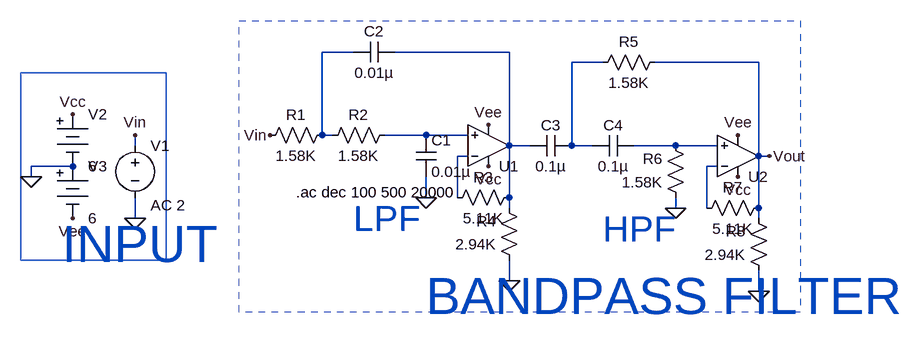
[diagram p0: schematic sallen-key-active-bandpass.asc]
sallen-key-active-bandpass.asc, the LTspice schematic file:
Version 4.1
SHEET 1 880 680
WIRE -112 64 -160 64
WIRE 128 64 -48 64
WIRE 272 80 224 80
WIRE 512 80 352 80
WIRE -160 192 -160 64
WIRE -144 192 -160 192
WIRE 0 192 -64 192
WIRE 64 192 0 192
WIRE -448 208 -448 192
WIRE 128 208 128 64
WIRE 160 208 128 208
WIRE 224 208 224 80
WIRE 256 208 224 208
WIRE 384 208 320 208
WIRE 448 208 384 208
WIRE 64 224 48 224
WIRE 512 224 512 80
WIRE 528 224 512 224
WIRE -544 240 -608 240
WIRE 448 240 432 240
WIRE -608 256 -608 240
WIRE 0 288 0 256
WIRE 48 288 48 224
WIRE 128 288 128 208
WIRE 128 304 128 288
WIRE 384 304 384 288
WIRE 432 304 432 240
WIRE 512 304 512 224
WIRE -448 320 -448 288
WIRE 512 320 512 304
WIRE 128 416 128 384
WIRE 512 432 512 400
FLAG -448 320 0
FLAG -240 192 Vin
FLAG 528 224 Vout
FLAG 0 288 0
FLAG 128 416 0
FLAG -608 256 0
FLAG -544 160 Vcc
FLAG 96 240 Vcc
FLAG -544 320 Vee
FLAG 96 176 Vee
FLAG 384 304 0
FLAG 512 432 0
FLAG 480 256 Vcc
FLAG 480 192 Vee
FLAG -448 192 Vin
SYMBOL OpAmps\\UniversalOpAmp2 96 208 M180
SYMATTR InstName U1
SYMBOL res -144 176 R90
WINDOW 0 0 56 VBottom 2
WINDOW 3 32 56 VTop 2
SYMATTR InstName R1
SYMATTR Value 1.58K
SYMATTR SpiceLine tol=1 pwr=0.1
SYMBOL cap -16 192 R0
SYMATTR InstName C1
SYMATTR Value 0.01µ
SYMATTR SpiceLine V=50 Irms=0 Rser=0.0124 Lser=188p mfg="Würth Elektronik" pn="885012009023 WCAP-CSGP 1210" type="NP0"
SYMBOL voltage -448 192 R0
WINDOW 123 24 108 Left 2
WINDOW 39 0 0 Left 0
SYMATTR Value2 AC 2
SYMATTR InstName V1
SYMATTR Value ""
SYMBOL res -48 176 R90
WINDOW 0 0 56 VBottom 2
WINDOW 3 32 56 VTop 2
SYMATTR InstName R2
SYMATTR Value 1.58K
SYMATTR SpiceLine tol=1 pwr=0.1
SYMBOL res 144 272 R90
WINDOW 0 0 56 VBottom 2
WINDOW 3 32 56 VTop 2
SYMATTR InstName R3
SYMATTR Value 5.11K
SYMATTR SpiceLine tol=1 pwr=0.1
SYMBOL res 144 400 R180
WINDOW 0 36 76 Left 2
WINDOW 3 36 40 Left 2
SYMATTR InstName R4
SYMATTR Value 2.94K
SYMATTR SpiceLine tol=1 pwr=0.1
SYMBOL cap -112 80 R270
WINDOW 0 32 32 VTop 2
WINDOW 3 0 32 VBottom 2
SYMATTR InstName C2
SYMATTR Value 0.01µ
SYMATTR SpiceLine V=50 Irms=0 Rser=0.0124 Lser=188p mfg="Würth Elektronik" pn="885012009023 WCAP-CSGP 1210" type="NP0"
SYMBOL Misc\\battery -544 144 R0
WINDOW 123 0 0 Left 0
WINDOW 39 0 0 Left 0
SYMATTR InstName V2
SYMATTR Value 6
SYMBOL Misc\\battery -544 224 R0
WINDOW 123 0 0 Left 0
WINDOW 39 0 0 Left 0
SYMATTR InstName V3
SYMATTR Value 6
SYMBOL OpAmps\\UniversalOpAmp2 480 224 M180
SYMATTR InstName U2
SYMBOL res 368 64 R90
WINDOW 0 0 56 VBottom 2
WINDOW 3 32 56 VTop 2
SYMATTR InstName R5
SYMATTR Value 1.58K
SYMATTR SpiceLine tol=1 pwr=0.1
SYMBOL cap 224 192 R90
WINDOW 0 0 32 VBottom 2
WINDOW 3 32 32 VTop 2
SYMATTR InstName C3
SYMATTR Value 0.1µ
SYMATTR SpiceLine V=50 Irms=1m Rser=1.9 Lser=2.5p mfg="Würth Elektronik" pn="865090668014 WCAP-ASLU 3.5x3.3" type="Al electrolytic"
SYMBOL res 400 304 R180
WINDOW 0 36 76 Left 2
WINDOW 3 36 40 Left 2
SYMATTR InstName R6
SYMATTR Value 1.58K
SYMATTR SpiceLine tol=1 pwr=0.1
SYMBOL res 528 288 R90
WINDOW 0 0 56 VBottom 2
WINDOW 3 32 56 VTop 2
SYMATTR InstName R7
SYMATTR Value 5.11K
SYMATTR SpiceLine tol=1 pwr=0.1
SYMBOL res 528 416 R180
WINDOW 0 36 76 Left 2
WINDOW 3 36 40 Left 2
SYMATTR InstName R8
SYMATTR Value 2.94K
SYMATTR SpiceLine tol=1 pwr=0.1
SYMBOL cap 320 192 R90
WINDOW 0 0 32 VBottom 2
WINDOW 3 32 32 VTop 2
SYMATTR InstName C4
SYMATTR Value 0.1µ
SYMATTR SpiceLine V=50 Irms=1m Rser=1.9 Lser=2.5p mfg="Würth Elektronik" pn="865090668014 WCAP-ASLU 3.5x3.3" type="Al electrolytic"
TEXT -200 280 Left 2 !.ac dec 100 500 20000
TEXT -112 320 Left 5 ;LPF
TEXT 272 336 Left 5 ;HPF
TEXT 0 440 Left 6 ;BANDPASS FILTER
TEXT -560 360 Left 6 ;INPUT
RECTANGLE Normal -400 384 -624 96
RECTANGLE Normal -288 16 -288 16 2
RECTANGLE Normal 576 464 -288 16 1

The netlist it stands for:
* sallen-key-active-bandpass.asc
X§U1 N004 N006 Vcc Vee N002 level2 Avol=1Meg GBW=10Meg Slew=10Meg Ilimit=25m Rail=0 Vos=0 En=0 Enk=0 In=0 Ink=0 Rin=500Meg  ; pins In+ In- V+ V- OUT
R1 N001 Vin 1.58K tol=1 pwr=0.1
C1 N004 0 0.01µ V=50 Irms=0 Rser=0.0124 Lser=188p mfg="Würth Elektronik" pn="885012009023 WCAP-CSGP 1210" type="NP0"
V1 Vin 0 AC 2
R2 N004 N001 1.58K tol=1 pwr=0.1
R3 N002 N006 5.11K tol=1 pwr=0.1
R4 0 N002 2.94K tol=1 pwr=0.1
C2 N001 N002 0.01µ V=50 Irms=0 Rser=0.0124 Lser=188p mfg="Würth Elektronik" pn="885012009023 WCAP-CSGP 1210" type="NP0"
V2 Vcc 0 6
V3 0 Vee 6
X§U2 N005 N007 Vcc Vee Vout level2 Avol=1Meg GBW=10Meg Slew=10Meg Ilimit=25m Rail=0 Vos=0 En=0 Enk=0 In=0 Ink=0 Rin=500Meg  ; pins In+ In- V+ V- OUT
R5 Vout N003 1.58K tol=1 pwr=0.1
C3 N003 N002 0.1µ V=50 Irms=1m Rser=1.9 Lser=2.5p mfg="Würth Elektronik" pn="865090668014 WCAP-ASLU 3.5x3.3" type="Al electrolytic"
R6 0 N005 1.58K tol=1 pwr=0.1
R7 Vout N007 5.11K tol=1 pwr=0.1
R8 0 Vout 2.94K tol=1 pwr=0.1
C4 N005 N003 0.1µ V=50 Irms=1m Rser=1.9 Lser=2.5p mfg="Würth Elektronik" pn="865090668014 WCAP-ASLU 3.5x3.3" type="Al electrolytic"
.ac dec 100 500 20000
* LPF
* HPF
* BANDPASS FILTER
* INPUT
.lib UniversalOpAmp2.lib
.backanno
.end